# Altium schematic sheet MPPT_CC_CV_Charger_A.SchDoc
size A4; SheetNumber: 4; SheetTotal: 10
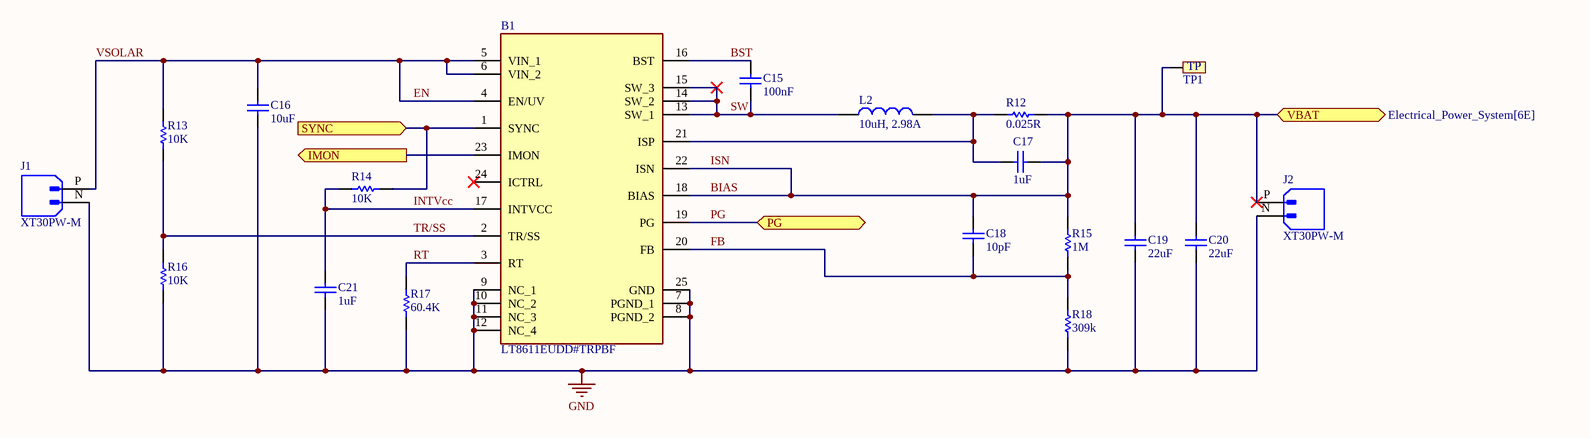
[diagram p0: MPPT_CC_CV_Charger_A.SchDoc]

## Parts
B1  LT8611EUDD#TRPBF  [QFN50P300X500X80-25N-D]
C15  value 100nF  [CAP-SM-0603]  (hidden comment: Cap Non-Pol SMD)
C16  value 10uF  [CAP-SM-0603]  (hidden comment: Cap Non-Pol SMD)
C17  value 1uF  [CAP-SM-0603]  (hidden comment: Cap Non-Pol SMD)
C18  value 10pF  [CAP-SM-0603]  (hidden comment: Cap Non-Pol SMD)
C19  value 22uF  [CAP-SM-0603]  (hidden comment: Cap Non-Pol SMD)
C20  value 22uF  [CAP-SM-0603]  (hidden comment: Cap Non-Pol SMD)
C21  value 1uF  [CAP-SM-0603]  (hidden comment: Cap Non-Pol SMD)
J1  XT30PW-M  [AMASS_XT30PW-M]
J2  XT30PW-M  [AMASS_XT30PW-M]
L2  10uH, 2.98A  [WE-PD2A_1054]
R12  value 0.025R  [RES-SM-0603]  (hidden comment: RESISTOR SMD)
R13  value 10K  [RES-SM-0603]  (hidden comment: RESISTOR SMD)
R14  value 10K  [RES-SM-0603]  (hidden comment: RESISTOR SMD)
R15  value 1M  [RES-SM-0603]  (hidden comment: RESISTOR SMD)
R16  value 10K  [RES-SM-0603]  (hidden comment: RESISTOR SMD)
R17  value 60.4K  [RES-SM-0603]  (hidden comment: RESISTOR SMD)
R18  value 309k  [RES-SM-0603]  (hidden comment: RESISTOR SMD)
TP1  Test Point  [TP]  (value not drawn)

## Ports
IMON (out, see Electrical_Power_System[7E]), PG (bidir, see Electrical_Power_System[7E]), SYNC (in, see Electrical_Power_System[7D], MPPT_CC_CV_Charger_B[1B]), VBAT (bidir, see Electrical_Power_System[6E])

## Nets
GND: B1.7(PGND_1) B1.8(PGND_2) B1.9(NC_1) B1.10(NC_2) B1.11(NC_3) B1.12(NC_4) B1.25(GND) C16.1 C19.1 C20.1 C21.1 J1.N J2.N R16.1 R17.1 R18.1
BIAS: B1.18(BIAS) B1.22(ISN) C17.1 C18.2 C19.2 C20.2 J2.P R12.1 R15.2 TP1.TP1 ; port VBAT  [also labelled ISN]
BST: B1.16(BST) C15.2
EN: B1.4(EN/UV) B1.5(VIN_1) B1.6(VIN_2) C16.2 J1.P R13.2  [also labelled VSOLAR]
FB: B1.20(FB) C18.1 R15.1 R18.2
IMON: B1.23(IMON) ; port IMON
INTVcc: B1.17(INTVCC) C21.2 R14.2
PG: B1.19(PG) ; port PG
RT: B1.3(RT) R17.2
SW: B1.13(SW_1) B1.14(SW_2) B1.15(SW_3) C15.1 L2.1
SYNC: B1.1(SYNC) R14.1 ; port SYNC
TR/SS: B1.2(TR/SS) R13.1 R16.2
NetB1_21: B1.21(ISP) C17.2 L2.2 R12.2

Not connected (* = marked no-connect by the designer): B1 24(ICTRL)*

## Notes on the sheet
- (in symbol Test Point) TP

## Library data of the parts
B1 = LT8611EUDD#TRPBF: 42V, 2.5A Synchronous Step-Down Regulator with Current Sense and 2.5uA Quiescent Current; Manufacturer_Name: Analog Devices; Geometry.Height: 0.8mm; Mouser Part Number: 584-LT8611EUDD#TRPBF; Mouser Price/Stock: https://www.mouser.co.uk/ProductDetail/Analog-Devices/LT8611EUDDTRPBF?qs=hVkxg5c3xu8xYINPiSHe4g%3D%3D; Manufacturer_Part_Number: LT8611EUDD#TRPBF; Datasheet Link: https://www.analog.com/LT8611/datasheet
C15-C21 = Cap Non-Pol SMD: Capacitor
J1 J2 = XT30PW-M: Socket; DC supply; XT30; male; PIN: 2; on PCBs; THT; Colour: yellow; MF: AMASS; SnapEDA_Link: https://www.snapeda.com/parts/XT30PW-M/AMASS/view-part/?ref=snap; Package: None; Value: *; MP: XT30PW-M; Check_prices: https://www.snapeda.com/parts/XT30PW-M/AMASS/view-part/?ref=eda
L2 = 78477610: WE-PD2A SMT Power Inductor, size 1054, 10uH, 2.98A; Manufacturer: Wurth Elektronik; DC Resistance max.: 0.06Ohm; Saturation Current: 3.24A; Self Resonant Frequency: 27.52MHz; DC Resistance typ.: 0.028Ohm; Rated Voltage: 80VDC; ComponentLink1Description: Datasheet; ComponentLink1URL: https://www.we-online.com/catalog/datasheet/78477610.pdf; Manufacturer Part Number: 78477610; Published Date: May 2020; Rated Current: 2.98A; Inductance: 10uH; Operating Temperature: -40 to +125degC; Packaging: Tape and Reel; Size: 1054; Supplier 1 URL: https://www.digikey.com/en/products/detail/w%C3%BCrth-elektronik/78477610/5168783?s=N4IgjCBcoGwJxVAYygMwIYBsDOBTANCAPZQDaIALAAxwDMdIAuoQA4AuUIAymwE4CWAOwDmIAL6EwAJjgRoIFJAw4CxMiADsYMBQAcTVh0jc%2BQ0RJBSqujYgVoseQiUjkwVAAQBWgBIGQ7JwAqoL8bADyqACyuOjYAK68uOKEVrr68orKTmqulgB0cLoeAIL%2BgcYhYZExcYnJYo1AA; Supplier 1 URL: https://www.mouser.vn/ProductDetail/Wurth-Elektronik/78477610?qs=sBf%2Fb4nBSlfmBIqyB8oiaA%3D%3D; Supplier 3 URL: N/A; Value: 10uH, 2.98A; Supplier 2 URL: N/A; LCSC Part #: N/A; Mount: SMD/SMT; Supplier 1: Mouser; Supplier 1 Part Number: 710-78477610; Supplier 2: Digi-Key; Supplier 2 Part Number: 732-6881-2-ND; Supplier 3: thegioiic; Supplier 3 Part Number: N/A
R12-R18 = RESISTOR SMD: Resistor